# Altium project ESC.PrjPcb
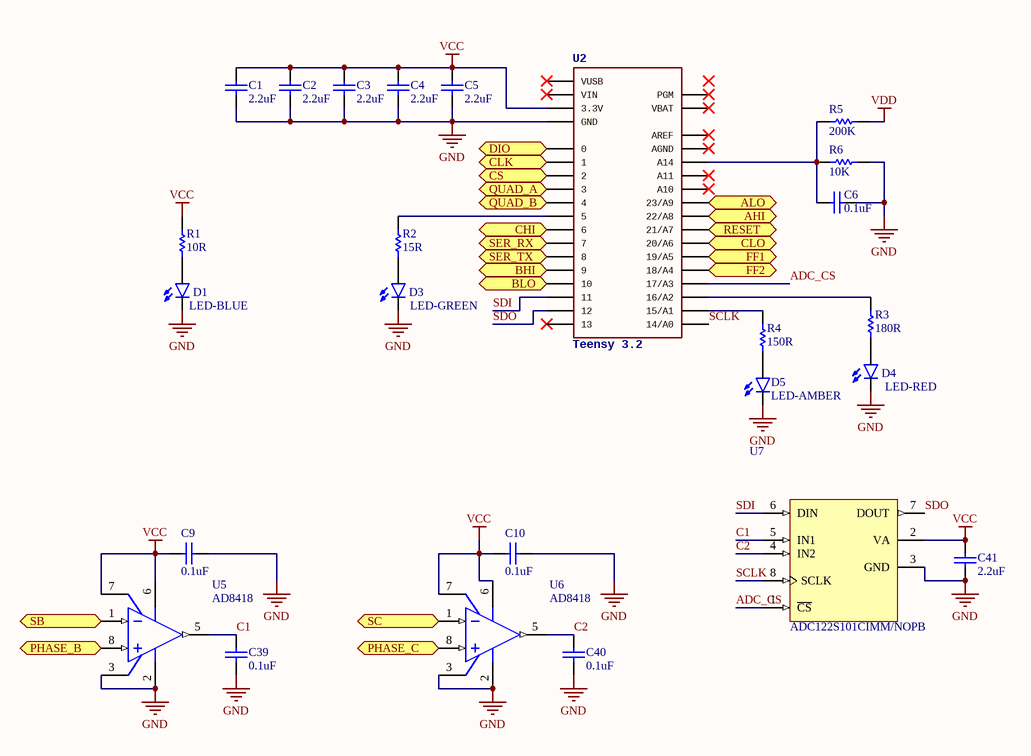
[diagram p0: MCU.SchDoc]
2 sheets, 80 parts. Net scope: flat (ports and power ports of the same name join across sheets).
Board file: ESC.PcbDoc
Sheets:
  MCU.SchDoc
  Power.SchDoc

## Sheet MCU.SchDoc
size A

### Parts
C1  2.2uF  [CAPC0603(1608)55_N]
C2  2.2uF  [CAPC0603(1608)55_N]
C3  2.2uF  [CAPC0603(1608)55_N]
C4  2.2uF  [CAPC0603(1608)55_N]
C5  2.2uF  [CAPC0603(1608)55_N]
C6  0.1uF  [CAPC0603(1608)100_L]
C9  0.1uF  [CAPC0603(1608)100_L]
C10  0.1uF  [CAPC0603(1608)100_L]
C39  0.1uF  [CAPC0603(1608)100_M]
C40  0.1uF  [CAPC0603(1608)100_M]
C41  2.2uF  [CAPC0603(1608)100_L]
D1  LED-BLUE  [LED-1206]
D3  LED-GREEN  [LED-1206]
D4  LED-RED  [LED-1206]
D5  LED-AMBER  [LED-1206]
R1  10R  [RESC0603(1608)_N]
R2  15R  [RESC0603(1608)_N]
R3  180R  [RESC0603(1608)_N]
R4  150R  [RESC0603(1608)_N]
R5  200K  [RESC0603(1608)_N]
R6  10K  [RESC0603(1608)_N]
U2  Teensy 3.2  [TEENSY_3.0+4]
U5  AD8418  [MSOP-8]
U6  AD8418  [MSOP-8]
U7  ADC122S101CIMM/NOPB  [MUA08A_L]

### Ports
AHI (out), ALO (out), BHI (out), BLO (out), CHI (out), CLK (out), CLO (out), CS (out), DIO (in), FF1 (in), FF2 (in), PHASE_B (in), PHASE_C (in), QUAD_A (in), QUAD_B (in), RESET (out), SB (in), SC (in), SER_RX (in), SER_TX (in)

### Nets
GND: C1.1 C2.1 C3.1 C4.1 C5.1 C6.2 C9.1 C10.1 C39.1 C40.1 C41.1 D1.C D3.C D4.C D5.C R6.2 U2.GND_GND1(GND) U5.2(GND) U5.3(VREF2) U6.2(GND) U6.3(VREF2) U7.3(GND)
VCC: C1.2 C2.2 C3.2 C4.2 C5.2 C9.2 C10.2 C41.2 R1.2 U2.3.3V_3.3V1(3.3V) U5.6(VS) U5.7(VREF1) U6.6(VS) U6.7(VREF1) U7.2(VA)
VDD: R5.2
ADC_CS: U2.17/A3 U7.1(~{CS})
C1: C39.2 U5.5(OUT) U7.5(IN1)
C2: C40.2 U6.5(OUT) U7.4(IN2)
SB: U5.1(IN-) ; port SB
SC: U6.1(IN-) ; port SC
SCLK: U2.14/A0 U7.8(SCLK)
SDI: U2.11 U7.6(DIN)
SDO: U2.12 U7.7(DOUT)
NetC6_1: C6.1 R5.1 R6.1 U2.A14
NetD1_A: D1.A R1.1
NetD3_A: D3.A R2.1
NetD4_A: D4.A R3.1
NetD5_A: D5.A R4.1
NetR2_2: R2.2 U2.5
NetR3_2: R3.2 U2.16/A2
NetR4_2: R4.2 U2.15/A1
NetR11_1: U5.8(IN+) ; port PHASE_B
NetR12_1: U6.8(IN+) ; port PHASE_C
NetU1_2: U2.21/A7 ; port RESET
NetU1_4: U2.18/A4 ; port FF2
NetU1_5: U2.19/A5 ; port FF1
NetU1_6: U2.23/A9 ; port ALO
NetU1_7: U2.22/A8 ; port AHI
NetU1_8: U2.9 ; port BHI
NetU1_9: U2.10 ; port BLO
NetU1_10: U2.20/A6 ; port CLO
NetU1_11: U2.6 ; port CHI
NetU2_0: U2.0 ; port DIO
NetU2_1: U2.1 ; port CLK
NetU2_2: U2.2 ; port CS
NetU2_3: U2.3 ; port QUAD_A
NetU2_4: U2.4 ; port QUAD_B
NetU2_7: U2.7 ; port SER_RX
NetU2_8: U2.8 ; port SER_TX

Not connected (* = marked no-connect by the designer): U2 13* A10* A11* AGND* AREF* PGM* VBAT* VIN* VUSB*

### Library data of the parts
C1-C5 = CMP-1035-02762-1: CAP 2.2uF 16V Â±10% 0603 (1608 Metric) Thickness 0.55mm SMD; Case-EIA: 0603; Case-Metric: 1608; Max Thickness: 0.55 mm; Technology: SMT; Value: 2.2uF; Rated Voltage: 16 V; Tolerance: Â±10%
C6 = CMP-1035-02591-1: CAP 100nF 50V Â±5% 0603 (1608 Metric) Thickness 1mm SMD; Case-Metric: 1608; Case-EIA: 0603; Rated Voltage: 50 V; Max Thickness: 1 mm; Tolerance: Â±5%; Technology: SMT; Value: 100nF
C9 C10 = CMP-1035-02577-1: CAP 100nF 6.3V Â±20% 0603 (1608 Metric) Thickness 1mm SMD; Case-EIA: 0603; Case-Metric: 1608; Technology: SMT; Rated Voltage: 6.3 V; Value: 100nF; Max Thickness: 1 mm; Tolerance: Â±20%
C39 C40 = CMP-1035-02575-1: CAP 100nF 6.3V ±5% 0603 (1608 Metric) Thickness 1mm SMD; Tolerance: Â±5%; Case-Metric: 1608; Case-EIA: 0603; Technology: SMT; Rated Voltage: 6.3 V; Max Thickness: 1 mm; Value: 100nF
C41 = CMP-1035-02754-1: CAP 2.2uF 6.3V ±10% 0603 (1608 Metric) Thickness 1mm SMD; Case-EIA: 0603; Tolerance: Â±10%; Case-Metric: 1608; Technology: SMT; Value: 2.2uF; Rated Voltage: 6.3 V; Max Thickness: 1 mm
D1 = LED-BLUE1206: PROD_ID: DIO-09911
D3 = LED-GREEN1206: PROD_ID: DIO-00862
D4 = LED-RED1206: PROD_ID: DIO-09912
D5 = LED-AMBER1206
R1 = CMP-1012-00026-1: 10R 0.1W 5% 0603 (1608 Metric)  SMD; Case-Metric: 1608; Case-EIA: 0603; Value: 10.00 Ohm; Technology: SMT; Tolerance: 5 %; Power: 0.1 W
R2 = CMP-1012-00030-1: 15R 0.1W 5% 0603 (1608 Metric)  SMD; Case-EIA: 0603; Case-Metric: 1608; Value: 15.00 Ohm; Tolerance: 5 %; Technology: SMT; Power: 0.1 W
R3 = CMP-1012-00056-1: 180R 0.1W 5% 0603 (1608 Metric)  SMD; Value: 180.00 Ohm; Case-EIA: 0603; Case-Metric: 1608; Power: 0.1 W; Technology: SMT; Tolerance: 5 %
R4 = CMP-1012-00054-1: 150R 0.1W 5% 0603 (1608 Metric)  SMD; Case-EIA: 0603; Value: 150.00 Ohm; Case-Metric: 1608; Power: 0.1 W; Tolerance: 5 %; Technology: SMT
R5 = CMP-1012-00129-1: 200K 0.1W 5% 0603 (1608 Metric)  SMD; Case-EIA: 0603; Value: 200000.00 Ohm; Case-Metric: 1608; Technology: SMT; Power: 0.1 W; Tolerance: 5 %
R6 = CMP-1012-00098-1: 10K 0.1W 5% 0603 (1608 Metric)  SMD; Case-EIA: 0603; Value: 10000.00 Ohm; Case-Metric: 1608; Technology: SMT; Tolerance: 5 %; Power: 0.1 W
U2 = TEENSY_3.0+4: pin to pad: 3.3V 3.3V1>3.3V+3.3V1 GND GND1>GND+GND1
U7 = CMP-0054-00398-2: 2 Channel, 500 kSPS to 1 MSPS 12-Bit A/D Converter, 8-pin Mini SOIC, Pb-Free; Manufacturer: National Semiconductor; CompType: ADC IC; PackageTopMarking: ZXTT*X24C; PowerWise: Y; ComponentLink1URL: http://www.national.com/ds/AD/ADC122S101.pdf; RoHS: Y; Code_JEDEC: MO-187-AA; RevisionNote: Component URLs added; PinCount: 8; PackageVersion: revF, Apr-2008; ComponentLink2URL: http://www.national.com/pf/AD/ADC122S101.html; ComponentLink3Description: MUA08A Package Page; ComponentLink3URL: http://www.national.com/packaging/folders/mua08a.html; PackageReference: MUA08A; PackageDescription: MINI SOIC, .118 x .118 x .034in, 8 Lead, .0256in Pitch; ComponentLink1Description: ADC122S101 Datasheet; ComponentLink2Description: ADC122S101 Web Page; DatasheetVersion: Jan-2010

## Sheet Power.SchDoc
size A
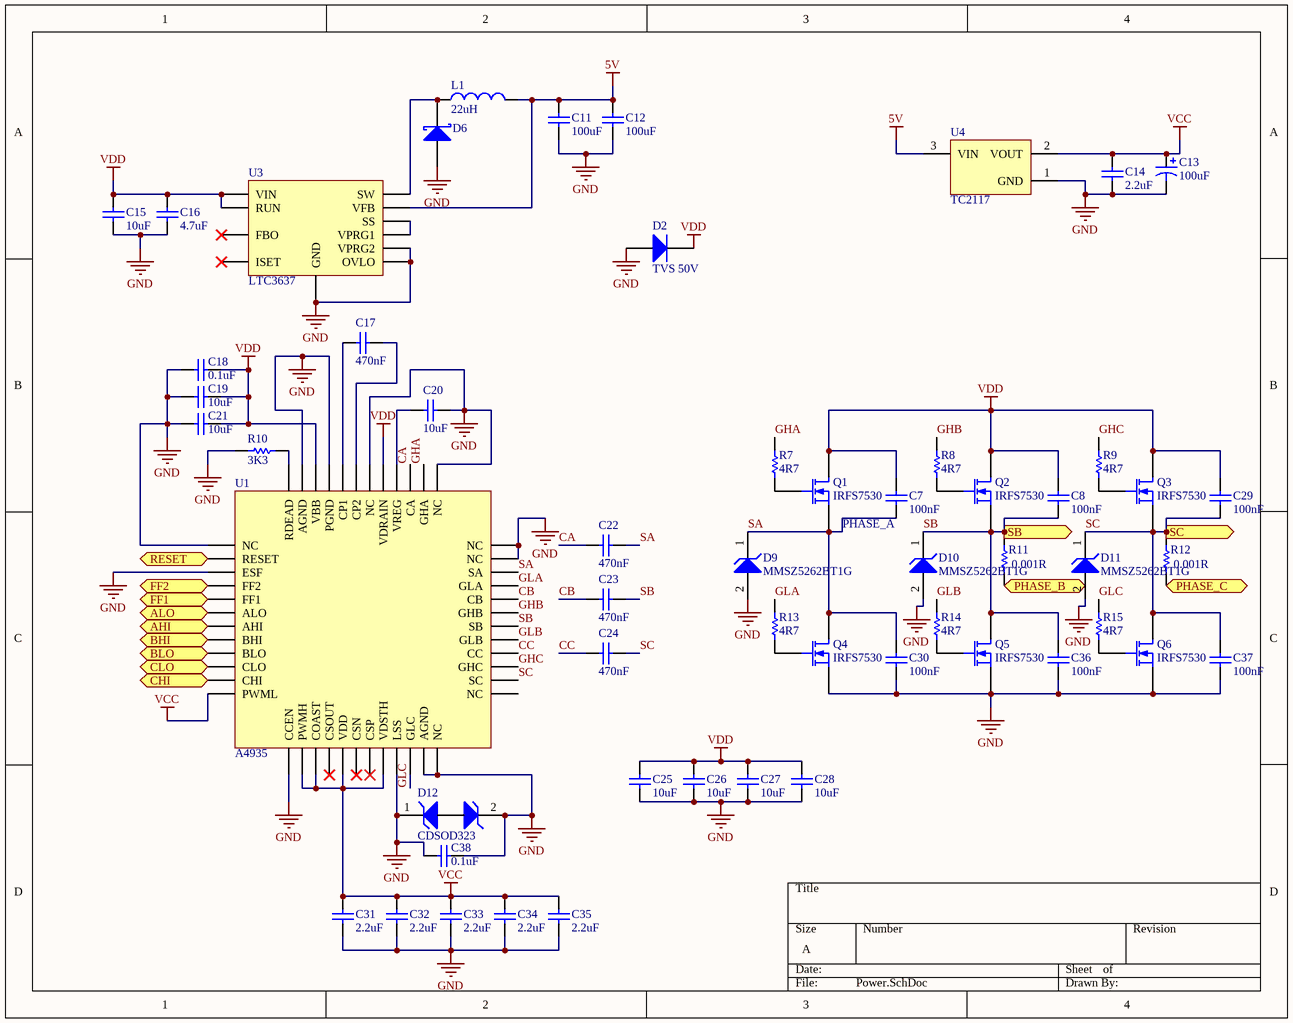
[diagram p1: Power.SchDoc]

### Parts
C7  100nF  [CAPC0603(1608)100_L]
C8  100nF  [CAPC0603(1608)100_L]
C11  100uF  [CAPC1210(3225)280_N]
C12  100uF  [CAPC1210(3225)280_N]
C13  100uF  [AVX-CAPC7343_V]
C14  2.2uF  [CAPC0603(1608)55_N]
C15  10uF  [CAPC1206(3216)190_M]
C16  4.7uF  [CAPC0805(2012)145_N]
C17  470nF  [CAPC0603(1608)100_N]
C18  0.1uF  [CAPC0603(1608)100_L]
C19  10uF  [CAPC1206(3216)190_M]
C20  10uF  [CAPC0805(2012)145_N]
C21  10uF  [CAPC1206(3216)190_M]
C22  470nF  [CAPC0603(1608)100_L]
C23  470nF  [CAPC0603(1608)100_L]
C24  470nF  [CAPC0603(1608)100_L]
C25  10uF  [CAPC1206(3216)190_M]
C26  10uF  [CAPC1206(3216)190_M]
C27  10uF  [CAPC1206(3216)190_M]
C28  10uF  [CAPC1206(3216)190_M]
C29  100nF  [CAPC0603(1608)100_L]
C30  100nF  [CAPC0603(1608)100_L]
C31  2.2uF  [CAPC0603(1608)55_N]
C32  2.2uF  [CAPC0603(1608)55_N]
C33  2.2uF  [CAPC0603(1608)55_N]
C34  2.2uF  [CAPC0603(1608)55_N]
C35  2.2uF  [CAPC0603(1608)55_N]
C36  100nF  [CAPC0603(1608)100_L]
C37  100nF  [CAPC0603(1608)100_L]
C38  0.1uF  [CAPC0603(1608)100_M]
D2  TVS 50V  [VISH-DO-214AC-2_N]
D6  (no value)  [SMB]
D9  MMSZ5262BT1G  [ONSC-SOD-123-2-425-04_V]
D10  MMSZ5262BT1G  [ONSC-SOD-123-2-425-04_V]
D11  MMSZ5262BT1G  [ONSC-SOD-123-2-425-04_V]
D12  CDSOD323  [SOD323]
L1  value 22uH  [SDR0805-180ML]  (hidden comment: SDR0805-180ML)
Q1  IRFS7530  [DPAK127P1525X483-7N]
Q2  IRFS7530  [DPAK127P1525X483-7N]
Q3  IRFS7530  [DPAK127P1525X483-7N]
Q4  IRFS7530  [DPAK127P1525X483-7N]
Q5  IRFS7530  [DPAK127P1525X483-7N]
Q6  IRFS7530  [DPAK127P1525X483-7N]
R7  4R7  [RESC0603(1608)_N]
R8  4R7  [RESC0603(1608)_N]
R9  4R7  [RESC0603(1608)_N]
R10  3K3  [RESC0603(1608)_N]
R11  value 0.001R  [Shunt]
R12  value 0.001R  [Shunt]
R13  4R7  [RESC0603(1608)_N]
R14  4R7  [RESC0603(1608)_N]
R15  4R7  [RESC0603(1608)_N]
U1  A4935  [LQFP-48]
U3  LTC3637  [SON50P300X85_HS-17N]
U4  TC2117  [SOT-223-DB3_M]

### Ports
AHI (in), ALO (in), BHI (in), BLO (in), CHI (in), CLO (in), FF1 (out), FF2 (out), PHASE_B (out), PHASE_C (out), RESET (in), SB (out), SC (out)

### Nets
5V: C11.2 C12.2 L1.2 U3.9(VFB) U4.3(VIN)
GND: C11.1 C12.1 C13.2 C14.2 C15.1 C16.2 C18.1 C19.1 C20.2 C21.1 C25.1 C26.1 C27.1 C28.1 C30.1 C31.1 C32.1 C33.1 C34.1 C35.1 C36.1 C37.1 C38.1 C38.2 D2.2(A) D6.1(A) D9.2(A) D10.2(A) D11.2(A) D12.1(K) D12.2(K) Q4.3(S) Q5.3(S) Q6.3(S) R10.1 U1.1(NC) U1.3(ESF) U1.13(CCEN) U1.21(LSS) U1.23(AGND) U1.24(NC) U1.35(NC) U1.36(NC) U1.37(NC) U1.42(NC) U1.45(PGND) U1.47(AGND) U3.6(VPRG2) U3.12(OVLO) U3.17(GND) U4.1(GND)
VCC: C13.1 C14.1 C31.2 C32.2 C33.2 C34.2 C35.2 U1.12(PWML) U1.14(PWMH) U1.15(COAST) U1.17(VDD) U1.20(VDSTH) U4.2(VOUT)
VDD: C7.2 C8.2 C15.2 C16.1 C18.2 C19.2 C21.2 C25.2 C26.2 C27.2 C28.2 C29.2 D2.1(K) Q1.1(D) Q2.1(D) Q3.1(D) U1.41(VDRAIN) U1.46(VBB) U3.3(VIN) U3.14(RUN)
CA: C22.1 U1.39(CA)
CB: C23.1 U1.32(CB)
CC: C24.1 U1.28(CC)
GHA: R7.2 U1.38(GHA)
GHB: R8.2 U1.31(GHB)
GHC: R9.2 U1.27(GHC)
GLA: R13.2 U1.33(GLA)
GLB: R14.2 U1.29(GLB)
GLC: R15.2 U1.22(GLC)
SA: C7.1 C22.2 C30.2 D9.1(K) Q1.3(S) Q4.1(D) U1.34(SA)
SB: C8.1 C23.2 C36.2 D10.1(K) Q2.3(S) Q5.1(D) R11.2 U1.30(SB) ; port SB
SC: C24.2 C29.1 C37.2 D11.1(K) Q3.3(S) Q6.1(D) R12.2 U1.26(SC) ; port SC
NetC17_1: C17.1 U1.44(CP1)
NetC17_2: C17.2 U1.43(CP2)
NetC20_1: C20.1 U1.40(VREG)
NetD6_2: D6.2(K) L1.1 U3.1(SW)
NetQ1_2: Q1.2(G) R7.1
NetQ2_2: Q2.2(G) R8.1
NetQ3_2: Q3.2(G) R9.1
NetQ4_2: Q4.2(G) R13.1
NetQ5_2: Q5.2(G) R14.1
NetQ6_2: Q6.2(G) R15.1
NetR10_2: R10.2 U1.48(RDEAD)
NetR11_1: R11.1 ; port PHASE_B
NetR12_1: R12.1 ; port PHASE_C
NetU1_2: U1.2(RESET) ; port RESET
NetU1_4: U1.4(FF2) ; port FF2
NetU1_5: U1.5(FF1) ; port FF1
NetU1_6: U1.6(ALO) ; port ALO
NetU1_7: U1.7(AHI) ; port AHI
NetU1_8: U1.8(BHI) ; port BHI
NetU1_9: U1.9(BLO) ; port BLO
NetU1_10: U1.10(CLO) ; port CLO
NetU1_11: U1.11(CHI) ; port CHI
NetU3_7: U3.7(VPRG1) U3.10(SS)

Not connected (* = marked no-connect by the designer): U1 16(CSOUT)* 18(CSN)* 19(CSP)* 25(NC); U3 5(FBO)* 11(ISET)*

### Notes on the sheet
- PHASE_A

### Library data of the parts
C7 C8 C18 C29 C30 C36 C37 = CMP-1035-02591-1: CAP 100nF 50V ±5% 0603 (1608 Metric) Thickness 1mm SMD; Tolerance: Â±5%; Case-Metric: 1608; Case-EIA: 0603; Rated Voltage: 50 V; Max Thickness: 1 mm; Technology: SMT; Value: 100nF
C11 C12 = CMP-1038-02301-1: CAP 100uF 10V Â±10% 1210 (3225 Metric) Thickness 2.8mm SMD; Case-EIA: 1210; Case-Metric: 3225; Rated Voltage: 6.3 V; Value: 100uF; Tolerance: Â±10%; Technology: SMT; Max Thickness: 2.8 mm
C13 = AVX-CAP-P-2
C14 C31-C35 = CMP-1035-02762-1: as C1 on sheet MCU; Max Thickness: 0.55 mm; Technology: SMT; Value: 2.2uF; Rated Voltage: 16 V; Tolerance: Â±10%
C15 C19 C21 C25-C28 = CMP-1037-04982-1: CAP 10uF 50V Â±10% 1206 (3216 Metric) Thickness 1.9mm SMD; Case-EIA: 1206; Case-Metric: 3216; Technology: SMT; Tolerance: Â±10%; Max Thickness: 1.9 mm; Value: 10uF; Rated Voltage: 50 V
C16 = CMP-1036-04900-1: CAP 4.7uF 50V Â±10% 0805 (2012 Metric) Thickness 1.45mm SMD; Case-Metric: 2012; Case-EIA: 0805; Value: 4.7uF; Tolerance: Â±10%; Technology: SMT; Max Thickness: 1.45 mm; Rated Voltage: 50 V
C17 = CMP-1035-02704-1: CAP 470nF 25V Â±20% 0603 (1608 Metric) Thickness 1mm SMD; Case-Metric: 1608; Case-EIA: 0603; Technology: SMT; Rated Voltage: 25 V; Max Thickness: 1 mm; Value: 470nF; Tolerance: Â±20%
C20 = CMP-1036-04932-1: CAP 10uF 25V Â±10% 0805 (2012 Metric) Thickness 1.45mm SMD; Case-EIA: 0805; Case-Metric: 2012; Technology: SMT; Value: 10uF; Rated Voltage: 25 V; Max Thickness: 1.45 mm; Tolerance: Â±10%
C22-C24 = CMP-1035-02703-1: CAP 470nF 25V Â±10% 0603 (1608 Metric) Thickness 1mm SMD; Case-Metric: 1608; Case-EIA: 0603; Tolerance: Â±10%; Rated Voltage: 25 V; Max Thickness: 1 mm; Technology: SMT; Value: 470nF
C38 = CMP-1035-02575-1: as C39 on sheet MCU; Technology: SMT; Rated Voltage: 6.3 V; Max Thickness: 1 mm; Value: 100nF
D2 = CMP-0548-00253-1: Transient Voltage Suppressor, 6.40 to 231 V, 45 V Stand-off Voltage, Uni-Directional, -55 to 155 degC, 2-pin DO-214AC, Pb-Free, Tape and Reel; PartNumber: SMAJ45A-E3/61; Manufacturer: Vishay Semiconductor; IFSM: 40 A; VWM (V): 45; VBR Uni-Directional (V): 6.4 to 231; ID (uA): 1; PPPM (W): 400, 300; ComponentLink2Description: Datasheet; PackageReference: DO-214AC-2; ComponentLink3URL: http://www.vishay.com/docs/88390/smaj50a.pdf; DatasheetVersion: 12/8/2013; RoHS: TRUE; ComponentLink2URL: http://www.vishay.com/docs/88390/smaj50a.pdf; ComponentLink1Description: Manufacturer URL; PackageDescription: 2-Pin DO-214AC (SMA), Body 4.245 x 2.665 mm; Mounting Technology: Surface Mount; Packing: Tape and Reel; ComponentLink3Description: Package Specification; ComponentLink1URL: http://www.vishay.com/; Operating Junction and Storage Temperature Range: -55 to 150 degC
D6 = D Schottky: Schottky Diode; Published: 8-Jun-2000; LatestRevisionDate: 17-Jul-2002; LatestRevisionNote: Re-released for DXP Platform.; PackageReference: SMB; Publisher: Altium Limited; PackageDescription: DO-214-AA/SMB; 2 C-Bend Leads; Body 5.3 x 3.6 mm, inc. leads (LxW); Code_JEDEC: DO-214-AA
D9-D11 = CMP-1060-00504-1: Zener Voltage Regulator, 500 mW, 2-Pin SOD-123, Pb-Free, Tape and Reel; Manufacturer: On Semiconductor; P Max (W): 0.5; VZ Typ (V): 51; PartNumber: MMSZ5262BT1G; PackageVersion: Rev. G, 10/2009; ComponentLink3Description: Package Specification; PackageReference: SOD-123-2-425-04; PackageDescription: 2-Pin SOD, Body 1.6 x 2.69 mm; ComponentLink1Description: Manufacturer URL; ComponentLink2Description: Datasheet; DatasheetVersion: Rev. 12; Mounting Technology: Surface Mount; Packing: Tape and Reel; RoHS: Pb-Free; ComponentLink1URL: http://www.onsemi.com/; ComponentLink3URL: http://www.onsemi.com/pub_link/Collateral/425-04.PDF; ComponentLink2URL: http://www.onsemi.com/pub_link/Collateral/MMSZ5221BT1-D.PDF
D12 = CDSOD323: Zener Voltage Regulator, 500 mW, 2-Pin SOD-123, Pb-Free, Tape and Reel; PartNumber: MMSZ5262BT1G; Manufacturer: On Semiconductor; P Max (W): 0.5; VZ Typ (V): 51; PackageVersion: Rev. G, 10/2009; ComponentLink3Description: Package Specification; PackageReference: SOD-123-2-425-04; PackageDescription: 2-Pin SOD, Body 1.6 x 2.69 mm; ComponentLink1Description: Manufacturer URL; ComponentLink2Description: Datasheet; DatasheetVersion: Rev. 12; Mounting Technology: Surface Mount; Packing: Tape and Reel; RoHS: Pb-Free; ComponentLink1URL: http://www.onsemi.com/; ComponentLink3URL: http://www.onsemi.com/pub_link/Collateral/425-04.PDF; ComponentLink2URL: http://www.onsemi.com/pub_link/Collateral/MMSZ5221BT1-D.PDF
L1 = SDR0805-180ML: Inductor; Code_IEC: 1005; Published: 8-Jun-2000; LatestRevisionDate: 29-May-2009; LatestRevisionNote: IPC-7351 Footprint Added.; PackageReference: 0402-A; Publisher: Altium Limited; PackageDescription: Chip Inductor; Code_JEITA: 0402
Q1-Q6 = IRFS7530: N-Channel MOSFET; pin to pad: 1>8 2>1 3>2+3+5+6+7; Published: 8-Jun-2000; LatestRevisionDate: 17-Jul-2002; LatestRevisionNote: Re-released for DXP Platform.; PackageVersion: 1995/1996; PackageReference: E3; Publisher: Altium Limited; PackageDescription: TO, Flat Index; 3 In-Line, Axial Leads; Body Dia. 4.6mm; Lead Dia. 0.5 mm (max)
R7-R9 R13-R15 = CMP-1012-00018-1: 4R7 0.1W 5% 0603 (1608 Metric)  SMD; Value: 4.70 Ohm; Case-EIA: 0603; Case-Metric: 1608; Power: 0.1 W; Tolerance: 5 %; Technology: SMT
R10 = CMP-1012-00086-1: 3K3 0.1W 5% 0603 (1608 Metric)  SMD; Case-EIA: 0603; Value: 3300.00 Ohm; Case-Metric: 1608; Technology: SMT; Tolerance: 5 %; Power: 0.1 W
R11 = Shunt: 0.001R; Published: 8-Jun-2000; LatestRevisionDate: 17-Jul-2002; LatestRevisionNote: Re-released for DXP Platform.; PackageReference: AXIAL-0.3; Publisher: Altium Limited; PackageDescription: Axial Device, Thru-Hole; 2 Leads; 0.3 in Pin Spacing
R12 = Shunt: Resistor; Published: 8-Jun-2000; LatestRevisionDate: 17-Jul-2002; LatestRevisionNote: Re-released for DXP Platform.; PackageReference: AXIAL-0.3; Publisher: Altium Limited; PackageDescription: Axial Device, Thru-Hole; 2 Leads; 0.3 in Pin Spacing
U1 = A4935: pin to pad: 23>23+47+49 47>47+23+49
U3 = LTC3637: pin to pad: 17>8+16+17
U4 = PM-LINEREG-TC2117-IL4: pin to pad: 2>2+4

## Nets that join several sheets
GND: MCU (22 pins), Power (51 pins)
VCC: MCU (15 pins), Power (13 pins)
VDD: MCU (R5.2), Power (20 pins)
NetR11_1: MCU (U5.8), Power (R11.1)
NetR12_1: MCU (U6.8), Power (R12.1)
NetU1_2: MCU (U2.21/A7), Power (U1.2)
NetU1_4: MCU (U2.18/A4), Power (U1.4)
NetU1_5: MCU (U2.19/A5), Power (U1.5)
NetU1_6: MCU (U2.23/A9), Power (U1.6)
NetU1_7: MCU (U2.22/A8), Power (U1.7)
NetU1_8: MCU (U2.9), Power (U1.8)
NetU1_9: MCU (U2.10), Power (U1.9)
NetU1_10: MCU (U2.20/A6), Power (U1.10)
NetU1_11: MCU (U2.6), Power (U1.11)
SB: MCU (U5.1), Power (8 pins)
SC: MCU (U6.1), Power (8 pins)